# EAGLE design MaTouch 1.9“ TFT Breakout v1.1 (EAGLE 6.1)
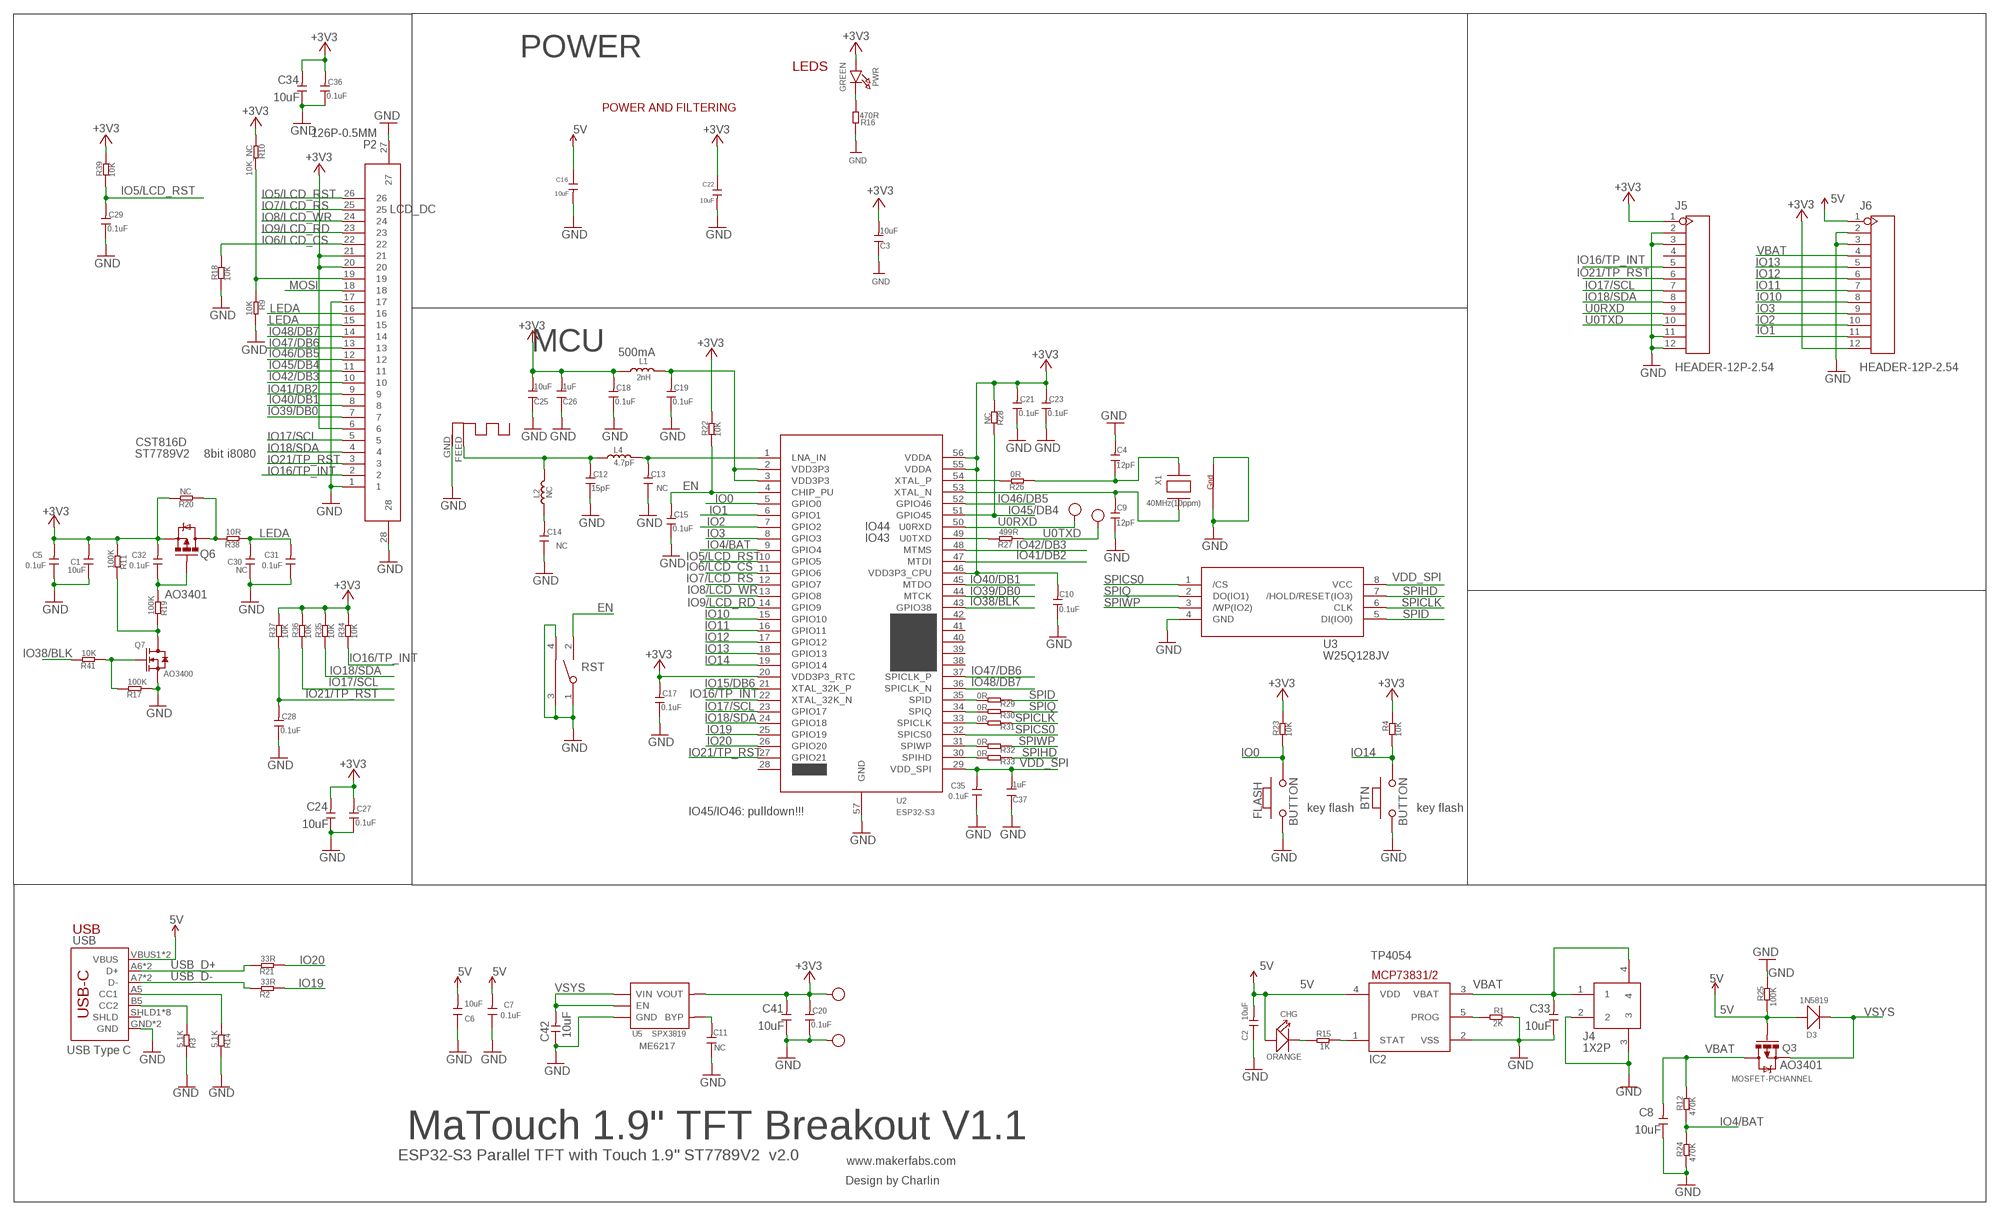
[diagram p0: schematic, sheet 1]

## Parts
ANT1  ANTENNA  [RN-ANT]
BTN  BUTTON  PB157  [157SW]
C1  10uF  C-0603  [0603]
C2  10uF  C-0603  [0603]
C3  10uF  DISCRETE_C-0603  [DISCRETE_C0603]
C4  12pF  DISCRETE_C-0402  [DISCRETE_C0402]
C5  0.1uF  DISCRETE_C-0402  [DISCRETE_C0402]
C6  10uF  DISCRETE_C-0603  [DISCRETE_C0603]
C7  0.1uF  DISCRETE_C-0402  [DISCRETE_C0402]
C8  10uF  C-0603  [0603]
C9  12pF  DISCRETE_C-0402  [DISCRETE_C0402]
C10  0.1uF  DISCRETE_C-0402  [DISCRETE_C0402]
C11  NC  DISCRETE_C-0402  [DISCRETE_C0402]
C12  15pF  DISCRETE_C-0402  [DISCRETE_C0402]
C13  NC  DISCRETE_C-0402  [DISCRETE_C0402]
C14  NC  DISCRETE_C-0402  [DISCRETE_C0402]
C15  0.1uF  DISCRETE_C-0402  [DISCRETE_C0402]
C16  10uF  C-0603  [0603]
C17  0.1uF  DISCRETE_C-0402  [DISCRETE_C0402]
C18  0.1uF  DISCRETE_C-0402  [DISCRETE_C0402]
C19  0.1uF  DISCRETE_C-0402  [DISCRETE_C0402]
C20  0.1uF  DISCRETE_C-0402  [DISCRETE_C0402]
C21  0.1uF  DISCRETE_C-0402  [DISCRETE_C0402]
C22  10uF  C-0603  [0603]
C23  0.1uF  DISCRETE_C-0402  [DISCRETE_C0402]
C24  10uF  C-0603  [0603]
C25  10uF  DISCRETE_C-0603  [DISCRETE_C0603]
C26  1uF  DISCRETE_C-0603  [DISCRETE_C0603]
C27  0.1uF  DISCRETE_C-0402  [DISCRETE_C0402]
C28  0.1uF  DISCRETE_C-0402  [DISCRETE_C0402]
C29  0.1uF  DISCRETE_C-0402  [DISCRETE_C0402]
C30  NC  C-0603  [0603]
C31  0.1uF  DISCRETE_C-0402  [DISCRETE_C0402]
C32  0.1uF  DISCRETE_C-0402  [DISCRETE_C0402]
C33  10uF  C-0603  [0603]
C34  10uF  C-0603  [0603]
C35  0.1uF  DISCRETE_C-0402  [DISCRETE_C0402]
C36  0.1uF  DISCRETE_C-0402  [DISCRETE_C0402]
C37  1uF  DISCRETE_C-0603  [DISCRETE_C0603]
C41  10uF  C-0603  [0603]
C42  10uF  C-0603  [0603]
CHG  ORANGE  007-LED0603  [D0603]
D3  1N5819  D'0805'  [SOD323]
FLASH  BUTTON  PB157  [157SW]
G  TEST-POINT'4545'  [TP-D45MIL]
IC2  MCP73831/OT  [SOT23-5L]
J4  1X2P  [1X2P-SMT1.25MM]
J5  HEADER-12P-2.54  [12P-2.54]
J6  HEADER-12P-2.54  [12P-2.54]
L1  2nH  DISCRETE_L0603  [DISCRETE_L0603]
L2  NC  DISCRETE_L0402  [DISCRETE_L0402]
L4  4.7pF  DISCRETE_L0402  [DISCRETE_L0402]
P2  126P-0.5MM  [1*26P-SMT0.5MM]
PWR  GREEN  LED0805_NOOUTLINE  [CHIPLED_0805_NOOUTLINE]
Q3  MOSFET-PCHANNEL  [SOT23-3]
Q6  MOSFET-PCHANNEL  [SOT23-3]
Q7  AO3400  DISCRETE_MOSFET-NSOT23  [DISCRETE_SOT23]
R1  2K  DISCRETE_R-0402  [DISCRETE_R0402]
R2  33R  DISCRETE_R-0402  [DISCRETE_R0402]
R3  5.1K  DISCRETE_R-0402  [DISCRETE_R0402]
R4  10K  DISCRETE_R-0402  [DISCRETE_R0402]
R9  10K  DISCRETE_R-0402  [DISCRETE_R0402]
R10  10K_NC  DISCRETE_R-0402  [DISCRETE_R0402]
R11  100K  DISCRETE_R-0402  [DISCRETE_R0402]
R12  470K  DISCRETE_R-0402  [DISCRETE_R0402]
R14  5.1K  DISCRETE_R-0402  [DISCRETE_R0402]
R15  1K  DISCRETE_R-0402  [DISCRETE_R0402]
R16  470R  DISCRETE_R-0402  [DISCRETE_R0402]
R17  100K  DISCRETE_R-0402  [DISCRETE_R0402]
R18  10K  DISCRETE_R-0402  [DISCRETE_R0402]
R19  100K  DISCRETE_R-0402  [DISCRETE_R0402]
R20  NC  DISCRETE_R-0402  [DISCRETE_R0402]
R21  33R  DISCRETE_R-0402  [DISCRETE_R0402]
R22  10K  DISCRETE_R-0402  [DISCRETE_R0402]
R23  10K  DISCRETE_R-0402  [DISCRETE_R0402]
R24  470K  DISCRETE_R-0402  [DISCRETE_R0402]
R25  100K  DISCRETE_R-0402  [DISCRETE_R0402]
R26  0R  DISCRETE_R-0402  [DISCRETE_R0402]
R27  499R  DISCRETE_R-0402  [DISCRETE_R0402]
R28  NC  DISCRETE_R-0402  [DISCRETE_R0402]
R29  0R  DISCRETE_R-0402  [DISCRETE_R0402]
R30  0R  DISCRETE_R-0402  [DISCRETE_R0402]
R31  0R  DISCRETE_R-0402  [DISCRETE_R0402]
R32  0R  DISCRETE_R-0402  [DISCRETE_R0402]
R33  0R  DISCRETE_R-0402  [DISCRETE_R0402]
R34  10K  DISCRETE_R-0402  [DISCRETE_R0402]
R35  10K  DISCRETE_R-0402  [DISCRETE_R0402]
R36  10K  DISCRETE_R-0402  [DISCRETE_R0402]
R37  10K  DISCRETE_R-0402  [DISCRETE_R0402]
R38  10R  DISCRETE_R-0402  [DISCRETE_R0402]
R39  10K  DISCRETE_R-0402  [DISCRETE_R0402]
R41  10K  DISCRETE_R-0402  [DISCRETE_R0402]
RST  TS24CA  [2*4*3.5MM]
RX  TEST-POINT'4545'  [TP-D45MIL]
TX  TEST-POINT'4545'  [TP-D45MIL]
U2  ESP32-S3  [QFN56-7*7MM]
U3  W25Q128JV  [SOIC-8-208MIL]
U5  SPX3819  [SOT23-5]
USB  USB_C5  [USB-C-16P-5]
V  TEST-POINT'4545'  [TP-D45MIL]
X1  40MHz(10ppm)  XTAL-4-3225  [NX3225]

## Nets
5V: C2.2 C6.2 C7.2 C16.1 CHG.+ D3.+ IC2.4(VDD) J6.1 Q3.1(G) R25.1 USB.VBUS1(VBUS) USB.VBUS2(VBUS)
+3V3: C1.2 C3.2 C5.2 C10.2 C17.2 C18.2 C20.2 C21.2 C22.1 C23.2 C24.2 C25.2 C26.2 C27.2 C32.2 C34.2 C36.2 C41.2 J5.1 J6.12 L1.1 P2.6 P2.20 P2.21 PWR.A Q6.2(S) R4.2 R10.2 R11.1 R20.2 R22.2 R23.2 R28.1 R34.2 R35.2 R36.2 R37.2 R39.2 U2.20(VDD3P3_RTC) U2.46(VDD3P3_CPU) U2.55(VDDA) U2.56(VDDA) U5.5(VOUT) V.T
EN: C15.2 R22.1 RST.2 U2.4(CHIP_PU)
GND: ANT1.GND BTN.1 C1.1 C2.1 C3.1 C4.2 C5.1 C6.1 C7.1 C8.1 C9.1 C10.1 C11.1 C12.1 C13.1 C14.1 C15.1 C16.2 C17.1 C18.1 C19.1 C20.1 C21.1 C22.2 C23.1 C24.1 C25.1 C26.1 C27.1 C28.1 C29.1 C30.1 C31.1 C33.1 C34.1 C35.1 C36.1 C37.1 C41.1 C42.1 FLASH.1 G.T IC2.2(VSS) J4.2 J4.3 J5.2 J5.3 J5.11 J5.12 J6.2 J6.3 P2.1 P2.17 P2.27 P2.28 Q7.2(S) R1.2 R3.2 R9.1 R14.2 R16.1 R17.1 R18.1 R24.1 R25.2 RST.1 RST.3 RST.4 U2.57(GND) U3.4(GND) U5.2(GND) USB.GND USB.GND2(GND) X1.2(G2) X1.4(G1)
IO0: FLASH.2 R23.1 U2.5(GPIO0)
IO1: J6.11 U2.6(GPIO1)
IO2: J6.10 U2.7(GPIO2)
IO3: J6.9 U2.8(GPIO3)
IO4/BAT: R12.1 R24.2 U2.9(GPIO4)
IO5/LCD_RST: C29.2 P2.26 R39.1 U2.10(GPIO5)
IO6/LCD_CS: P2.22 R18.2 U2.11(GPIO6)
IO7/LCD_RS: P2.25 U2.12(GPIO7)
IO8/LCD_WR: P2.24 U2.13(GPIO8)
IO9/LCD_RD: P2.23 U2.14(GPIO9)
IO10: J6.8 U2.15(GPIO10)
IO11: J6.7 U2.16(GPIO11)
IO12: J6.6 U2.17(GPIO12)
IO13: J6.5 U2.18(GPIO13)
IO14: BTN.2 R4.1 U2.19(GPIO14)
IO15/DB6: U2.21(XTAL_32K_P)
IO16/TP_INT: J5.5 P2.2 R34.1 U2.22(XTAL_32K_N)
IO17/SCL: J5.7 P2.5 R36.1 U2.23(GPIO17)
IO18/SDA: J5.8 P2.4 R35.1 U2.24(GPIO18)
IO19: R2.1 U2.25(GPIO19)
IO20: R21.1 U2.26(GPIO20)
IO21/TP_RST: C28.2 J5.6 P2.3 R37.1 U2.27(GPIO21)
IO38/BLK: R41.2 U2.43(GPIO38)
IO39/DB0: P2.7 U2.44(MTCK)
IO40/DB1: P2.8 U2.45(MTDO)
IO41/DB2: P2.9 U2.47(MTDI)
IO42/DB3: P2.10 U2.48(MTMS)
IO45/DB4: P2.11 R28.2 U2.51(GPIO45)
IO46/DB5: P2.12 U2.52(GPIO46)
IO47/DB6: P2.13 U2.37(SPICLK_P)
IO48/DB7: P2.14 U2.36(SPICLK_N)
LEDA: C30.2 C31.2 P2.15 P2.16 R38.1
MOSI: P2.18
N$2: IC2.5(PROG) R1.1
N$3: C32.1 Q6.1(G) R19.1
N$6: R14.1 USB.A5(CC1)
N$7: PWR.C R16.2
N$8: P2.19 R9.2 R10.1
N$10: Q6.3(D) R20.1 R38.2
N$14: R3.1 USB.B5(CC2)
N$15: Q7.3(D) R11.2 R19.2
N$19: Q7.1(G) R17.2 R41.1
N$25: CHG.- R15.1
N$26: IC2.1(STAT) R15.2
N$30: ANT1.FEED C12.2 L2.2 L4.1
N$31: C13.2 L4.2 U2.1(LNA_IN)
N$32: R29.2 U2.35(SPID)
N$33: C19.2 L1.2 U2.2(VDD3P3) U2.3(VDD3P3)
N$34: C14.2 L2.1
N$35: R30.2 U2.34(SPIQ)
N$37: R26.2 U2.54(XTAL_P)
N$38: R31.2 U2.33(SPICLK)
N$40: R32.2 U2.31(SPIWP)
N$41: R33.2 U2.30(SPIHD)
N$63: R27.2 U2.49(U0TXD)
N$65: C9.2 U2.53(XTAL_N) X1.3(X2)
N$66: C4.1 R26.1 X1.1(X1)
N$76: C11.2 U5.4(BYP)
SPICLK: R31.1 U3.6(CLK)
SPICS0: U2.32(SPICS0) U3.1(/CS)
SPID: R29.1 U3.5(DI(IO0))
SPIHD: R33.1 U3.7(/HOLD/RESET(IO3))
SPIQ: R30.1 U3.2(DO(IO1))
SPIWP: R32.1 U3.3(/WP(IO2))
U0RXD: J5.9 RX.T U2.50(U0RXD)
U0TXD: J5.10 R27.1 TX.T
USB_D+: R21.2 USB.A6(D+) USB.B6(D+)
USB_D-: R2.2 USB.A7(D-) USB.B7(D-)
VBAT: C8.2 C33.2 IC2.3(VBAT) J4.1 J4.4 J6.4 Q3.3(D) R12.2
VDD_SPI: C35.2 C37.2 U2.29(VDD_SPI) U3.8(VCC)
VSYS: C42.2 D3.- Q3.2(S) U5.1(VIN) U5.3(EN)
Unconnected: J5.4 U2.28(SPICS1) U2.38(GPIO33) U2.39(GPIO34) U2.40(GPIO35) U2.41(GPIO36) U2.42(GPIO37) USB.SHLD1(SHLD) USB.SHLD2(SHLD) USB.SHLD3(SHLD) USB.SHLD4(SHLD) USB.SHLD5(SHLD) USB.SHLD6(SHLD) USB.SHLD7(SHLD) USB.SHLD8(SHLD)

## Notes on the sheet
- POWER
- LEDS
- POWER AND FILTERING
- LCD_DC
- MCU
- 500mA
- CST816D
- ST7789V2 | 8bit i8080
- IO44
- IO43
- AO3401
- RST
- key flash | key flash
- IO45/IO46: pulldown!!!
- USB
- TP4054
- ME6217
- USB Type C
- AO3401
- MaTouch 1.9" TFT Breakout V1.1
- ESP32-S3 Parallel TFT with Touch 1.9" ST7789V2  v2.0
- www.makerfabs.com
- Design by Charlin

## Library data of the parts
ANT1 = adafruit:ANTENNA
BTN FLASH = MySMD:PB157
C1 C2 C8 C16 C22 C24 C30 C33 C34 C41 C42 = Discrete:C*: Ceramic Capacitors
C3-C7 C9-C15 C17-C21 C23 C25-C29 C31 C32 C35-C37 = A9G:DISCRETE_C*: Ceramic Capacitors
CHG = Discrete:007-LED*
D3 = Discrete:D*
G RX TX V = Discrete-new:TEST-POINT; PARTNO: DNP
IC2 = adafruit:MCP73831: MCP73831/2 Miniature Single-Cell, Fully Integrated Li-Ion, Li-Polymer Charge Management Controllers. Nice and small simple lipoly charge controller, with adjustable current and status output (LED) http://www.ladyada.net/library/pcb/eaglelibrary.html
J4 = sale:1X2P
J5 J6 = Connector:HEADER-12P
L1 L2 L4 = A9G:DISCRETE_L*
P2 = sale:1*26P-0.5MM
PWR = microbuilder:LED: LED 0603 - 0603 Surface Mount Package 2mA: Green LED - Low Power (3.9mcd, 2ma, 1.7Vf) - Digikey: 475-2709-2-ND Orange LED - Low Power (9.8mcd, 2ma, 1.8Vf) - Digikey: 475-1194-2-ND Red LED - Low Power (5mcd, 2ma, 1.8Vf) - Digikey: 475-1195-2-ND Yellow LED - Low Power (7mcd, 2ma, 1.8Vf) - Digikey: 475-1196-2-ND 5mA: Blue LED - Low Power (17mcd, 5ma, 2.9Vf) - Digikey: LNJ937W8CRACT-ND 0805 - 0805 Surface Mount Package 2mA: Red LED (8.8mcd, 2mA, 1.8Vf, Clear) - Low Power [Digikey: 475-2510-1-ND] Green LED (5mcd, 2mA, 1.8Vf, Clear) - Low Power [Digikey: 475-2730-1-ND] Yellow LED (11.3mcd, 2mA, 1.8Vf, Clear) - Low Power [Digikey: 475-2555-1-ND] 20mA: Red LED (104mcd, 20mA, Diffused) - LS R976 [Digikey: 475-1278-6-ND] Red LED (12mcd, 20mA, 2.0Vf, Clear) - APT2012EC [Digikey: 754-1128-1-ND] Green LED (15mcd, 20mA, 2.2Vf, Clear) - APT2012GC [Digikey: 754-1131-1-ND] Orange LED (160mcd, 20mA, 2.1Vf, Clear) - APT2012SECK [Digikey: 754-1130-1-ND] 1206 - 1206 Surface Mount Package Green LED (26mcd, 20mA, Diffused) - LG N971 [Digikey: 475-1407-6-ND] Red LED (15mcd, 20mA, Diffused) - LH N974 [Digikey: 475-1416-6-ND] Cree - Cree High-Power Surface Mount LEDs XPEBWT-L1-0000-00D50 - White 111lm 350mA 2.9Vf 6200K 110° XTEAWT-00-0000-00000LEE3 - White 114lm 350mA 2.85Vf 5000K 115° Everlight - Everlight 45-21 Series Surface Mount LEDs 45-21/QK2C-B2832AC2CB2/2T - Warm White 2000mcd 20mA 3.25Vf 3050K 120° 45-21/LK2C-B38452C4CB2/2T - Nuetral White 2000mcd 20mA 3.25Vf 4150K 120° 45-21/LK2C-B50634C6CB2/2T - Cold White 2200mcd 20mA 3.25Vf 5650K 120° PLCC2 Reverse Mount LS T77K-J1L2-1-0-2-R18-Z - Red 11.25mcd 2mA 1.8Vf 630nm 120° LO T77K-L1M2-24-Z - Orange 19.6mcd 2mA 1.8Vf 606nm 120° LY T77K-K2M1-26-Z - Yellow 15.7mcd 2mA 1.8Vf 587nm 120°
Q3 Q6 = User-Submitted:MOSFET-PCHANNEL: Generic PMOSFET IRLML2244 - TRANS-11153 (SOT-23 -20V -4.3A) (1.Gate 2.Source 3.Drain) FQP27P06 - COM-10349 <http://www.sparkfun.com/products/10349> (TO-220 -60V -27A) (1.Gate 2.Source 3.Drain); PROD_ID: TRANS-08285
Q7 = A9G:DISCRETE_MOSFET-N: IRLL014: http://www.vishay.com/docs/91319/sihll014.pdf
R1-R4 R9-R12 R14-R39 R41 = A9G:DISCRETE_R*
RST = sale:TS24CA
U2 = sale:ESP32-S3
U3 = self:W25Q128JV
U5 = IC:SPX3819
USB = USBC:USB_C: USB Type C 16Pin Connector Super Speed pins not available on the 16-pin purely SMD connector so this part is best for USB 2.0 implementations. D1 and D2 are tied together enabling D+/- no matter which way the cable is plugged into the connector. The two channel configuration pins (CC1/2) are exposed. These are normally connected to ground via 5.1k resistors but can be reconfigured for high current/high power applications.
X1 = adafruit:XTAL-4: Classic 4-pin 3.2 x 2.5mm crystal

## Net classes
0 default: width 0.203 mm
1 vbat: width 0.254 mm, drill 0.305 mm, clearance 0.152 mm

## Board
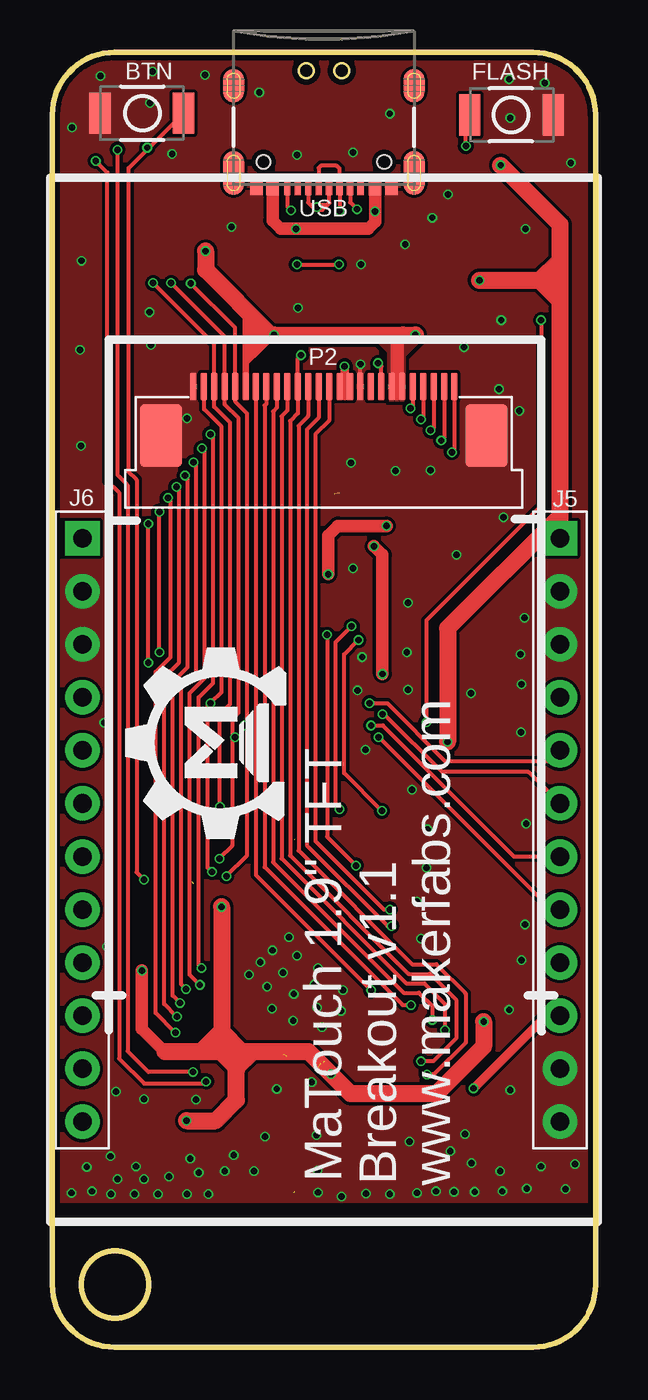
[diagram p1: board, top side]
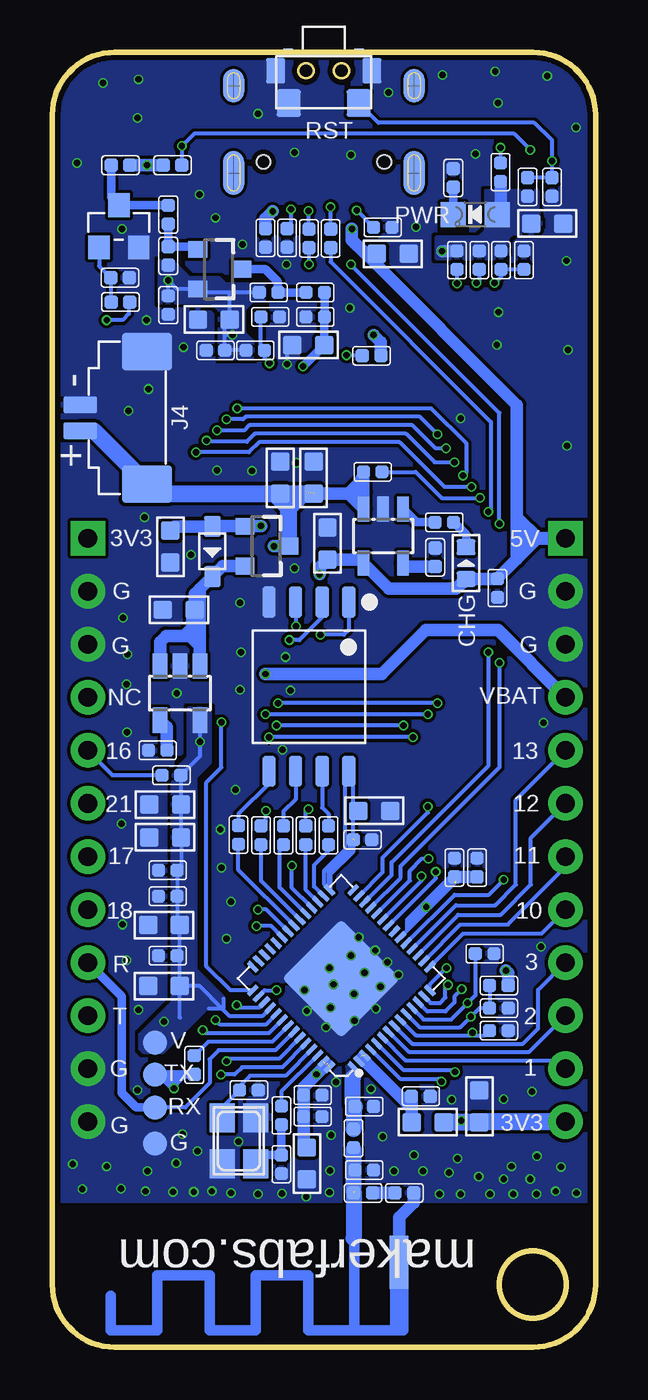
[diagram p2: board, bottom side, seen from below]

Size 26 x 62 mm. Coordinates in mm from the lower left corner, seen from the top.
Outline: 0,3 0,59 arc-90 3,62 23,62 arc-90 26,59 26,3 arc-90 23,0 3,0 arc-90 0,3
Outline: circle at 3,3 radius 1.6
Copper layers (1*16): Top 0.035mm / dielectric 1.5mm / Bottom 0.035mm
Design rules: minimum track width 6mil, minimum drill 10mil, track to track 6mil, track to pad 6mil, pad to pad 6mil, via to via 6mil, smd to smd 0mil, copper to edge 10mil, drill to drill 10mil, minimum pad ring 3mil, minimum via ring 3mil, stop-mask expansion 2mil, vias tented up to drill 100mil, thermal gap 0mil
tRestrict: area -0.1,-0.1 to 26,6.9
bRestrict: area -0.1,-0.1 to 26,6.9

### Footprints (pad centres in the part's own frame; a part is rotated, then mirrored left to right if it is on the bottom)
RN-ANT = smd 0.025 x 0.025: FEED 0,2.159 | smd 2.54 x 0.889: GND -1.143,0
157SW = smd 1.016 x 1.981: 1 0,0; 2 4,0
0603 = smd 0.889 x 0.889: 1 -0.762,0; 2 0.762,0
DISCRETE_C0603 = smd 0.889 x 0.889: 1 -0.762,0; 2 0.762,0
DISCRETE_C0402 = smd 0.635 x 0.635: 1 -0.445,0; 2 0.445,0
D0603 = smd 0.762 x 0.889: + -0.762,0; - 0.762,0
SOD323 = smd 1 x 0.8: + -1.2,0; - 1.2,0
TP-D45MIL = smd 1.143 x 1.143: T 0,0
SOT23-5L = smd 0.55 x 1.2: 1 -0.95,-1.3; 2 0,-1.3; 3 0.95,-1.3; 4 0.95,1.3; 5 -0.95,1.3
1X2P-SMT1.25MM = smd 0.8 x 1.6: 1 -0.625,0; 2 0.625,0 | smd 1.8 x 2.4: 3 3.175,-3.2; 4 -3.175,-3.2
12P-2.54 = drill 0.889 pad 1.651 square: 1 0,13.97 | drill 0.889 pad 1.651: 2 0,11.43; 3 0,8.89; 4 0,6.35; 5 0,3.81; 6 0,1.27; 7 0,-1.27; 8 0,-3.81; 9 0,-6.35; 10 0,-8.89; 11 0,-11.43; 12 0,-13.97
DISCRETE_L0603 = smd 0.889 x 0.889: 1 -0.762,0; 2 0.762,0
DISCRETE_L0402 = smd 0.635 x 0.635: 1 -0.445,0; 2 0.445,0
1*26P-SMT0.5MM = smd 0.3 x 1.3: 1 -6.25,0; 2 -5.75,0; 3 -5.25,0; 4 -4.75,0; 5 -4.25,0; 6 -3.75,0; 7 -3.25,0; 8 -2.75,0; 9 -2.25,0; 10 -1.75,0; 11 -1.25,0; 12 -0.75,0; 13 -0.25,0; 14 0.25,0; 15 0.75,0; 16 1.25,0; 17 1.75,0; 18 2.25,0; 19 2.75,0; 20 3.25,0; 21 3.75,0; 22 4.25,0; 23 4.75,0; 24 5.25,0; 25 5.75,0; 26 6.25,0 | smd 2 x 3: 27 7.79,-2.35; 28 -7.79,-2.35
CHIPLED_0805_NOOUTLINE = smd 1.2 x 1.2: A 0,-1.05; C 0,1.05
SOT23-3 = smd 0.8 x 0.9: 1 -0.95,-1; 2 0.95,-1; 3 0,1.1
DISCRETE_SOT23 = smd 1.016 x 1.143: 1 -0.95,-1.016; 2 0.95,-1.016; 3 0,1.016
DISCRETE_R0402 = smd 0.635 x 0.635: 1 -0.445,0; 2 0.445,0
2*4*3.5MM = smd 1.15 x 1.3: 1 -1.675,0; 2 1.675,0 | smd 0.9 x 1.2: 3 2.3,1.55; 4 -2.3,1.55
QFN56-7*7MM = smd 0.6 x 0.2: 1 -3.4,2.6; 2 -3.4,2.2; 3 -3.4,1.8; 4 -3.4,1.4; 5 -3.4,1; 6 -3.4,0.6; 7 -3.4,0.2; 8 -3.4,-0.2; 9 -3.4,-0.6; 10 -3.4,-1; 11 -3.4,-1.4; 12 -3.4,-1.8; 13 -3.4,-2.2; 14 -3.4,-2.6; 29 3.4,-2.6; 30 3.4,-2.2; 31 3.4,-1.8; 32 3.4,-1.4; 33 3.4,-1; 34 3.4,-0.6; 35 3.4,-0.2; 36 3.4,0.2; 37 3.4,0.6; 38 3.4,1; 39 3.4,1.4; 40 3.4,1.8; 41 3.4,2.2; 42 3.4,2.6 | smd 0.2 x 0.6: 15 -2.6,-3.4; 16 -2.2,-3.4; 17 -1.8,-3.4; 18 -1.4,-3.4; 19 -1,-3.4; 20 -0.6,-3.4; 21 -0.2,-3.4; 22 0.2,-3.4; 23 0.6,-3.4; 24 1,-3.4; 25 1.4,-3.4; 26 1.8,-3.4; 27 2.2,-3.4; 28 2.6,-3.4; 43 2.6,3.4; 44 2.2,3.4; 45 1.8,3.4; 46 1.4,3.4; 47 1,3.4; 48 0.6,3.4; 49 0.2,3.4; 50 -0.2,3.4; 51 -0.6,3.4; 52 -1,3.4; 53 -1.4,3.4; 54 -1.8,3.4; 55 -2.2,3.4; 56 -2.6,3.4 | smd 4 x 4: 57 0,0
SOIC-8-208MIL = smd 1.5 x 0.635: 1 -4.05,1.905; 2 -4.05,0.635; 3 -4.05,-0.635; 4 -4.05,-1.905; 5 4.05,-1.905; 6 4.05,-0.635; 7 4.05,0.635; 8 4.05,1.905
SOT23-5 = smd 0.69 x 1.2: 1 -0.95,-1.3; 2 0,-1.3; 3 0.95,-1.3; 4 0.95,1.3; 5 -0.95,1.3
USB-C-16P-5 = smd 0.3 x 1: A5 -1.25,-0.34; A6 -0.25,-0.34; A7 0.25,-0.34; A8 1.25,-0.34; B5 1.75,-0.34; B6 0.75,-0.34; B7 -0.75,-0.34; B8 -1.75,-0.34 | smd 0.6 x 1: GND -3.225,-0.34; GND2 3.225,-0.34; VBUS1 -2.45,-0.34; VBUS2 2.45,-0.34 | smd 1 x 2.1: SHLD1 -4.32,-0.915; SHLD2 4.32,-0.915 | smd 1 x 2.1 bottom: SHLD3 -4.32,-0.915; SHLD4 4.32,-0.915 | smd 1 x 1.6: SHLD5 -4.32,-5.095; SHLD8 4.32,-5.095 | smd 1 x 1.6 bottom: SHLD6 -4.32,-5.095; SHLD7 4.32,-5.095 | hole 0.65: -2.89,-1.445; 2.89,-1.445
NX3225 = smd 1.4 x 1.2: 1 -1.1,-0.8; 2 1.1,-0.8; 3 1.1,0.8; 4 -1.1,0.8

### Placement (x,y rotation side)
ANT1  9.4,5.21 90 bottom
BTN  2.29,59.08 0 top
C1  20.65,20.22 0 bottom
C2  12.83,38.48 270 bottom
C3  20.65,17.3 0 bottom
C4  15.04,8.76 270 bottom
C5  20.45,49.89 90 bottom
C6  20.35,38.33 90 bottom
C7  15.8,53.11 90 bottom
C8  15.09,41.63 270 bottom
C9  16.59,12.32 180 bottom
C10  5.66,22.96 270 bottom
C11  20.95,28.57 0 bottom
C12  11.07,8.48 180 bottom
C13  11.07,11.53 180 bottom
C14  9.14,7.39 180 bottom
C15  2.08,55.55 90 bottom
C16  9.71,52.35 0 bottom
C17  13.54,11.05 180 bottom
C18  13.54,12.06 180 bottom
C19  8.36,12.01 180 bottom
C20  6.76,22.96 270 bottom
C21  20.47,18.75 0 bottom
C22  13.81,8.8 270 bottom
C23  20.47,21.59 0 bottom
C24  5.56,11.53 270 bottom
C25  2.31,53.8 180 bottom
C26  20.6,24.41 0 bottom
C27  20.47,22.83 0 bottom
C28  3.43,52.04 270 bottom
C29  4.62,16.23 180 bottom
C30  13.74,47.98 0 bottom
C31  13.41,49.33 0 bottom
C32  20.45,52.25 270 bottom
C33  13.49,41.63 270 bottom
C34  20.6,25.98 0 bottom
C35  11.15,24.31 180 bottom
C36  18.19,47.73 0 bottom
C37  10.59,25.68 180 bottom
C41  18.26,49.2 0 bottom
C42  19.94,35.31 0 bottom
CHG  6.2,37.54 90 bottom
D3  18.34,38.1 270 bottom
FLASH  23.98,59 180 top
G  21.08,9.75 0 bottom
IC2  10.16,38.84 180 bottom
J4  24.66,44.5 90 bottom
J5  24.3,24.77 0 top
J6  1.44,24.77 0 top
L1  8.03,10.77 180 bottom
L2  11.13,7.39 180 bottom
L4  11.58,10.01 90 bottom
P2  13,46 0 top
PWR  5.76,54.23 90 bottom
Q3  15.77,38.35 270 bottom
Q6  18.03,51.61 270 bottom
Q7  22.81,53.67 0 bottom
R1  7.67,37.82 90 bottom
R2  13.72,53.09 90 bottom
R3  10.19,53.62 0 bottom
R4  4.55,56.26 270 bottom
R9  15.57,49.33 180 bottom
R10  16.28,47.73 180 bottom
R11  22.73,56.59 180 bottom
R12  10.67,41.91 180 bottom
R14  14.76,53.11 270 bottom
R15  7.24,39.5 180 bottom
R16  6.81,55.98 270 bottom
R17  22.76,51.21 180 bottom
R18  5.31,18.85 180 bottom
R19  20.45,54.23 90 bottom
R20  15.65,50.5 180 bottom
R21  12.67,53.09 90 bottom
R22  3.25,55.55 270 bottom
R23  20.24,56.59 180 bottom
R24  4.62,15.16 180 bottom
R25  4.7,36.35 270 bottom
R26  15.04,11.1 90 bottom
R27  19.2,13.51 90 bottom
R28  10.72,47.47 180 bottom
R29  17.09,24.54 270 bottom
R30  16,24.51 270 bottom
R31  14.94,24.51 270 bottom
R32  13.87,24.51 270 bottom
R33  12.78,24.51 270 bottom
R34  20.29,27.38 0 bottom
R35  5.56,52.04 90 bottom
R36  6.63,52.04 90 bottom
R37  4.52,52.04 90 bottom
R38  13.41,50.5 180 bottom
R39  4.62,17.32 0 bottom
R41  22.73,50.04 0 bottom
RST  13,59.56 0 bottom
RX  21.08,11.48 0 bottom
TX  21.08,13.06 0 bottom
U2  12.17,17.65 135 bottom
U3  13.72,31.62 270 bottom
U5  19.89,31.32 180 bottom
U$1  [MAKERFABS_0.3]  11.12,24.82 90 top
USB  13,55.3 180 top
V  21.08,14.58 0 bottom
X1  17.07,9.88 90 bottom

### Tracks (layer width: path | path; a pad name or v marks a point on that pad's centre or on a via)
5V  (via drill 0.3)
  Top 0.61: USB.VBUS1 v15.45,54.38 15.45,53.88 15.11,53.54 v11.66,53.54 10.95,53.54 10.55,53.94 USB.VBUS2 | v13.21,37.01 13.21,38.86 13.66,39.32 v16,39.32
  Bottom 0.203: 16.76,39.32 Q3.1
  Bottom 0.61: v16,39.32 16.76,39.32 | Q3.1 D3.+ 20.14,39.3 C6.2 | C7.2 15.8,54.03 v15.45,54.38 | v11.66,53.54 11.66,53.01 11,52.35 | 11,52.35 C16.1 | 3.76,37.73 R25.1 4.71,36.78 CHG.+ 6.66,36.32 9.89,36.32 IC2.4 11.29,37.72 C2.2 13.21,37.34 v13.21,37.01 | 3.76,37.73 3.76,39.09 | 3.76,39.73 3.76,45.11 11,52.35 | J6.1 2.76,38.73 3.76,37.73 | 1.45,38.71 2.74,38.71 3.76,39.73 | 3.76,39.73 3.76,39.09 | 3.76,39.09 3.23,38.56
+3V3  (via drill 0.3)  (4 unrouted)
  Top 0.203: P2.21 16.75,48.42 16.79,48.46
  Top 0.305: P2.6 9.25,47.14 | 9.25,47.14 v10.62,48.46 | 9.25,47.14 9.25,49.63
  Top 0.406: 9.25,49.63 9.53,49.4 9.53,47.57 9.83,47.88 9.83,48.67 10.11,48.39 10.11,48.08
  Top 0.61: 16.48,45.64 16.48,48.36 | 5.38,14.15 4.29,15.24 v4.29,18.03 | 6.99,14.2 8.08,15.29 9.22,14.15 9.73,14.15 8.81,13.23 7.95,14.1
  Top 0.813: v7.34,52.48 7.34,51.59 10.46,48.46 v10.62,48.46 16.79,48.46 v17.37,48.46 | J5.1 24.3,39.8 | 24.3,39.8 24.3,50.95 | 24.3,50.95 24.3,53.75 v21.46,56.59 | v20.45,51.08 23.32,51.08 | 23.32,51.08 23.34,51.08 | 23.34,51.08 24.17,51.08 24.3,50.95 | 23.34,51.08 24.28,52.02 24.28,50.11 23.32,51.08 | v18.92,28.98 18.92,34.42 24.3,39.8 | v20.65,15.6 20.65,14.4 18.39,12.14 14.28,12.14 v13.35,13.07 12.27,14.15 9.73,14.15 8.84,14.15 | 8.84,14.15 8.18,14.15 | 8.18,14.15 5.38,14.15 | v6.43,10.85 7.82,10.85 8.81,11.84 8.81,13.23 8.81,14.12 8.84,14.15 | v8.1,21.08 8.1,14.22 8.18,14.15
  Bottom 0.203: U2.20 8.05,20.92 | 8.05,20.92 6.76,22.21 C20.2 C10.2 | U2.46 15.95,15.85 17.5,15.85 17.8,16.15 | U5.5 18.94,28.29 R34.2 19.85,26 C34.2 C26.2 19.84,23.02 C27.2 C23.2 20.03,20.36 C1.2 19.89,18.8 | 17.86,16.2 18.95,17.3 C3.2 | 19.89,15.77 C3.2 | 6.64,52.48 R36.2 | 16.75,47.7 R10.2 C36.2 17.74,48.46 | 17.74,48.46 17.74,48.96 C41.2 17.5,50.44 17.55,50.49 | R20.2 17.55,50.49 | 17.55,50.49 18.87,50.49 Q6.2 20.03,50.66 v20.45,51.08 C5.2 | 4.55,54.39 PWR.A | 5.54,10.79 6.38,10.79 v6.43,10.85 | v17.37,48.46 17.74,48.46 | C3.2 19.89,18.8 | C21.2 19.94,18.75 19.89,18.8 | 17.8,16.69 17.8,16.15 | 17.8,16.15 17.86,16.2 | 17.86,16.2 18.49,16.2 | v8.1,21.08 8.1,20.98 8.05,20.92 | 9.02,19.96 9.02,20.47 6.76,22.73 5.49,22.73 5.49,22.3 6.68,22.3 8.71,20.27 8.91,20.27 8.91,20.32 6.63,22.61 5.94,22.61 5.94,22.4 6.5,22.4 6.5,22.43 | 12.6,13.59 12.85,13.84 14.15,12.55 14.15,9.86 13.77,9.86 13.77,12.37 12.57,13.56 12.6,13.59 | 12.6,13.59 12.83,13.59 14.05,12.37 14.05,11.73
  Bottom 0.305: C18.2 13.87,12.18 13.87,12.55 v13.35,13.07 12.9,13.51 12.9,13.54 12.98,13.61
  Bottom 0.406: C18.2 13.97,11.06 | 13.97,11.06 13.97,9.58 13.95,9.55 13.84,9.55 13.83,9.56 C22.1 | C17.2 13.97,11.06
  Bottom 0.61: v7.34,52.48 6.64,52.48 | 4.55,54.39 R4.2 | R28.1 10.27,48.12 v10.62,48.46 | R23.2 v21.46,56.59 R11.1 | R39.2 4.18,17.92 v4.29,18.03
  Bottom 0.813: J6.12 5.54,10.79 C24.2 L1.1
  pour Bottom: 7.62,52.15 4.37,52.15 4.19,52.32 4.19,53.11 3.96,53.34 2.62,53.34 2.62,54.23 2.77,54.38 2.77,55.35 5.26,55.35 5.26,53.44 5.59,53.11 7.62,53.11
  pour Bottom: 16.43,47.32 17.98,47.32 17.98,49.66 18.34,50.01 20.85,50.01 20.85,52.04 20.29,52.04 19.46,51.21 18.03,51.21 17.73,50.9 15.85,50.9 15.85,50.09 16.43,50.09 16.84,49.68 16.84,48.56 16.46,48.18 16.43,48.16
  pour Top: 16.1,45.36 16.84,45.36 16.84,47.5 17.6,48.26 17.6,48.59 15.42,48.59 15.42,48.36 16.1,47.68
  pour Bottom: 18.47,30.61 18.47,27.97 19.15,27.28 19.15,18.08 17.81,16.74 17.81,16.43 18.03,16.21 18.62,16.21 20.7,14.12 21.62,14.12 21.79,14.3 21.79,14.96 20.47,16.28 20.24,16.51 20.24,27.48 19.46,28.27 19.46,30.58 19.43,30.61
EN  (via drill 0.3)
  Top 0.203: v7.37,12.72 7.26,12.62 4.39,12.62 3.2,13.82 3.2,40.92 2.64,41.48 2.64,56.24 v2.08,56.79
  Bottom 0.203: U2.4 9.35,12.85 7.49,12.85 v7.37,12.72 | R22.1 C15.2 v2.08,56.79 2.08,57.78 2.92,58.62 10.39,58.62 RST.2
GND  (via drill 0.3)
  Top 0.203: P2.17 14.75,47.06 v14.76,47.07
  Bottom 0.203: v14.76,47.07 14.76,47.73 C30.1
  Bottom 0.61: ANT1.GND 9.4,6.22 8.7,6.92 C14.1
  other vias: 16.43,41.96 18.11,41.99 14.4,37.29 14.83,33.05 14.61,31.45 17.02,31.47 17.02,35.64 21.59,39.73 21.39,45.87 18.95,55.19 18.19,54.08 22.66,53.54 21.49,49.17 19.71,47.88 16.15,59.05 21.87,60.71 23.57,60.53 24.82,56.69 21.92,58.85 4.8,61.09 2.31,60.86 0.94,58.39 4.67,59.56 7.32,60.91 9.91,60.07 11.71,57.07 14.4,57.2 5.74,57.12 8.59,53.64 1.4,52.02 1.37,43.15 1.32,47.75 4.65,49.56 6.45,44.48 2.49,29.9 2.62,19.18 3.05,12.24 1.65,8.64 4.01,8.66 6.6,9.04 8.69,9.19 10.19,10.08 0.91,7.39 1.91,7.47 2.82,7.34 3.94,7.34 5.05,7.34 6.45,7.34 7.47,7.34 9.65,8.43 8.26,8.43 7.01,8.36 5.59,8.18 4.39,8.05 3.12,8.05 2.79,9.14 10.74,12.37 12.42,12.7 12.65,10.16 12.7,8.46 12.73,7.42 15.01,7.37 13.84,7.21 16.15,7.34 17.45,7.39 18.36,7.47 20.22,7.44 21.54,7.47 22.71,7.59 24.56,7.57 25.02,8.76 19.76,10.21 20.07,8.81 9.42,17.83 9.96,18.44 10.54,19 11.33,19.63 11.71,18.75 11.05,17.93 10.29,17.27 10.52,16.21 11.56,16.92 12.73,18.16 13.92,17.09 12.55,17.37 12.67,16.26 11.53,15.65 13.82,16.1 12.9,15.32 17.65,19.56 17.45,21.34 17.91,22.96 17.96,24.79 17.22,26.7 22.68,25.07 22.43,29.44 22.61,34.92 22.45,31.75 22.45,18.54 22.63,20.24 21.87,16.15 21.92,12.32 17.09,9.86 20.04,31.32 22.4,33.17 16.97,33.27 19.35,37.95 14.3,42.34 11.76,49.76 14.78,51.84 16.89,52.81 4.72,47.98 14.99,28.6 4.39,11.89 6.88,11.86 19.05,9.4 19.23,7.44 21.44,8.43 23.39,8.66 22.35,44.83
  pour Top (rank 6): -3,85 -3,-5 30,-5 30,85
  pour Bottom (rank 6): -5,-5 30,-5 30,85 -5,85
IO0  (via drill 0.3)
  Top 0.203: v3.12,57.33 3.12,41.76 3.61,41.27 3.61,14.17 4.6,13.18 v6.73,13.18 | v19.8,57.51 19.8,58.82 FLASH.2
  Bottom 0.203: U2.5 9.21,13.28 6.83,13.28 v6.73,13.18 | v3.12,57.33 3.89,58.09 19.21,58.09 v19.8,57.51 R23.1
IO1
  Bottom 0.203: U2.6 9.1,13.74 1.85,13.74 J6.11
IO2
  Bottom 0.203: U2.7 8.94,14.15 3.17,14.15 J6.10
IO3
  Bottom 0.203: U2.8 8.76,14.53 3.48,14.53 2.74,15.27 2.74,17.11 J6.9
IO4/BAT  (via drill 0.3)
  Top 0.203: v5.89,15.06 4.95,16 4.95,32.33 5.66,33.05 5.66,40.54 v5.54,40.66
  Bottom 0.203: U2.9 8.6,14.94 5.89,14.94 | 5.89,14.94 5.3,14.94 R24.2 | v5.89,15.06 5.89,14.94 | R12.1 8.61,41.91 7.37,40.66 v5.54,40.66
IO5/LCD_RST  (via drill 0.3)
  Top 0.203: v5.97,15.82 5.36,16.43 5.36,32.08 6.07,32.79 6.07,41.07 v5.94,41.2 | P2.26 19.25,42.97 v19.13,42.85
  Bottom 0.203: U2.10 8.42,15.32 6.48,15.32 v5.97,15.82 5.56,16.23 C29.2 R39.1 | v19.13,42.85 16.59,42.85 16.1,43.33 9.37,43.33 7.24,41.2 v5.94,41.2
IO6/LCD_CS  (via drill 0.3)
  Top 0.203: P2.22 17.25,45.06 v17.14,44.96 | v6.12,16.48 5.77,16.84 5.77,31.85 6.48,32.56 6.48,41.6 v6.35,41.73
  Bottom 0.203: U2.11 8.23,15.7 6.91,15.7 v6.12,16.48 5.75,16.85 R18.2 | v17.14,44.96 7.87,44.96 6.2,43.28 6.2,41.88 v6.35,41.73
IO7/LCD_RS  (via drill 0.3)
  Top 0.203: P2.25 18.77,45.98 18.77,43.56 v18.62,43.41 | v6.4,17.14 6.17,17.37 6.17,31.62 6.88,32.33 6.88,42.24 v6.76,42.37
  Bottom 0.203: U2.12 8.05,16.08 7.19,16.08 6.76,16.51 6.76,16.79 v6.4,17.14 | v18.62,43.41 18.57,43.36 16.69,43.36 16.31,43.74 9.07,43.74 7.7,42.37 v6.76,42.37
IO8/LCD_WR  (via drill 0.3)
  Top 0.203: P2.24 18.26,45.99 18.26,44.04 v18.11,43.89 | v7.06,17.35 6.58,17.83 6.58,31.32 7.29,32.03 7.29,42.9 v7.16,43.03
  Bottom 0.203: U2.13 7.89,16.48 7.44,16.48 7.19,16.74 7.19,17.22 v7.06,17.35 | v7.16,43.03 7.64,43.03 8.76,44.15 16.56,44.15 16.82,43.89 v18.11,43.89
IO9/LCD_RD  (via drill 0.3)
  Top 0.203: v7.14,18.16 7.01,18.29 7.01,31.11 7.7,31.8 7.7,43.59 v7.57,43.71 | P2.23 17.75,44.52 v17.65,44.42
  Bottom 0.203: U2.14 7.92,17.37 v7.14,18.16 | v7.57,43.71 8.41,44.55 16.74,44.55 16.87,44.42 v17.65,44.42
IO10
  Bottom 0.203: U2.15 6.33,19.81 2.58,19.81 J6.8
IO11
  Bottom 0.203: U2.16 6.46,20.24 4.19,20.24 1.44,23 J6.7
IO12
  Bottom 0.203: U2.17 6.57,20.7 4.55,20.7 3.1,22.15 3.1,24.38 J6.6
IO13
  Bottom 0.203: U2.18 6.68,21.16 4.8,21.16 3.81,22.15 3.81,26.2 J6.5
IO14  (via drill 0.3)
  Top 0.203: BTN.2 4.55,57.34 | 4.55,57.34 3.66,56.45 3.66,41.91 4.04,41.53 4.04,22.73 v4.39,22.38 | 4.55,57.34 v4.55,57.43
  Bottom 0.203: U2.19 6.74,21.67 5.11,21.67 v4.39,22.38 | R4.1 v4.55,57.43
IO16/TP_INT  (via drill 0.3)
  Top 0.203: P2.2 7.26,45.99 7.26,44.91 8.1,44.07 8.1,31.37 v7.57,30.84 7.44,30.71 7.44,22.96 v7.64,22.76 | v15.19,30.84 16.03,30.84 18.8,28.07 23.79,28.07 J5.5
  Bottom 0.203: U2.22 7.64,22.45 v7.64,22.76 | U2.22 10.03,20.07 10.06,20.07 | U2.22 | v7.57,30.84 v15.19,30.84 | R34.1 23.11,27.38 J5.5
IO17/SCL  (via drill 0.3)
  Top 0.203: 9.32,29.74 9.32,23.55 v8.33,22.55 | 9.32,29.74 9.32,44.7 8.76,45.26 8.76,45.99 P2.5 8.75,48.81 v6.63,50.93 | v9.2,29.77 9.3,29.77 9.32,29.74 | v15.27,29.77 15.82,29.77 22.1,23.5 J5.7
  Bottom 0.203: U2.23 8.33,22.33 v8.33,22.55 | v9.2,29.77 v15.27,29.77 | R36.1 v6.63,50.93
IO18/SDA  (via drill 0.3)
  Top 0.203: 8.23,45.98 P2.4 | 8.61,29.21 8.61,30.07 8.91,30.38 8.91,44.48 8.25,45.14 P2.4 | 8.61,29.21 8.61,24 v8,23.39 | P2.4 8.25,48.39 v5.69,50.95 | v8.74,29.21 8.61,29.21 | v15.62,29.21 23.88,20.95 J5.8
  Bottom 0.203: U2.24 8.89,22.34 8.89,22.81 8.31,23.39 v8,23.39 | v8.74,29.21 v15.62,29.21 | R35.1 5.56,51.08 v5.69,50.95
IO19  (via drill 0.3)
  Top 0.203: v4.6,32.77 v4.6,39.42 | v11.71,51.84 v13.72,51.84
  Bottom 0.203: U2.25 9.32,22.48 9.32,23.04 4.6,27.76 v4.6,32.77 | v4.6,39.42 4.6,44.73 v11.71,51.84 | R2.1 v13.72,51.84
IO20  (via drill 0.3)
  Top 0.203: v5.13,33.27 v5.13,40.01
  Bottom 0.203: U2.26 9.75,22.61 9.75,23.22 5.13,27.84 v5.13,33.27 | R21.1 12.68,51.97 5,44.3 5,40.13 v5.13,40.01
IO21/TP_RST  (via drill 0.3)
  Top 0.203: P2.3 | P2.3 7.75,45.03 8.51,44.27 8.51,30.79 v8.03,30.3 v8.03,25.88 | P2.3 7.75,48.03 v4.83,50.95 | v15.8,30.3 15.9,30.3 18.67,27.53 22.8,27.53 J5.6
  Bottom 0.203: U2.27 10.19,22.75 10.19,23.44 8.03,25.6 v8.03,25.88 | v8.03,30.3 v15.8,30.3 | C28.2 R37.1 4.52,51.26 v4.83,50.95
IO38/BLK  (via drill 0.3)
  Top 0.203: v23.39,49.17 23.39,40.28 17.91,34.8 v17.91,29.92
  Bottom 0.203: U2.43 17.47,17.09 18.62,18.24 18.62,27.05 17.91,27.76 v17.91,29.92 | R41.2 22.33,50 22.33,49.48 22.63,49.17 v23.39,49.17
IO39/DB0  (via drill 0.3)
  Top 0.203: P2.7 9.75,22.61 v15.27,17.09
  Bottom 0.203: U2.44 15.84,17.09 v15.27,17.09
IO40/DB1  (via drill 0.3)
  Top 0.203: P2.8 10.25,45.17 10.16,45.09 10.16,22.99 16.76,16.38 v17.17,16.38
  Bottom 0.203: U2.45 16.11,16.26 17.04,16.26 v17.17,16.38
IO41/DB2  (via drill 0.3)
  Top 0.203: P2.9 10.75,44.99 10.57,44.81 10.57,23.22 16.82,16.97 17.55,16.97 18.19,16.33 v18.19,15.67
  Bottom 0.203: U2.47 15.79,15.44 17.96,15.44 v18.19,15.67
IO42/DB3  (via drill 0.3)
  Top 0.203: P2.10 11.25,44.85 10.97,44.58 10.97,23.39 16.94,17.42 17.8,17.42 18.8,16.43 v18.8,15.19
  Bottom 0.203: U2.48 15.63,15.04 18.64,15.04 v18.8,15.19
IO45/DB4  (via drill 0.3)
  Top 0.203: v17.65,13.69 18.24,13.69 19.33,14.78 19.33,16.64 18.09,17.88 17.04,17.88 11.38,23.55 11.38,44.35 11.75,44.72 P2.11 11.75,47.34 v11.91,47.5
  Bottom 0.203: U2.51 14.15,14.81 15.14,13.82 17.53,13.82 v17.65,13.69 | R28.2 11.89,47.47 v11.91,47.5
IO46/DB5  (via drill 0.3)
  Top 0.203: P2.12 12.25,44.58 11.79,44.12 11.79,23.77 17.22,18.34 18.39,18.34 19.79,16.94 19.79,14.58 18.26,13.06 v17.93,13.06
  Bottom 0.203: U2.52 14.99,13.41 16.92,13.41 17.27,13.06 v17.93,13.06
IO47/DB6  (via drill 0.3)
  Top 0.203: P2.13 12.75,44.5 12.19,43.94 12.19,24.03 16.05,20.17 v16.23,20.17
  Bottom 0.203: U2.37 15.53,20.17 v16.23,20.17
IO48/DB7  (via drill 0.3)
  Top 0.203: P2.14 13.25,44.37 12.6,43.71 12.6,24.23 15.88,20.95 v16.15,20.95
  Bottom 0.203: U2.36 15.75,20.95 v16.15,20.95
LEDA  (via drill 0.3)
  Top 0.203: P2.15 P2.16 13.99,45.74 13.99,45.54
  Top 0.406: v13.99,46.97 13.99,45.54
  Bottom 0.406: v13.99,46.97 C30.2 12.98,49.31 C31.2 R38.1
N$2
  Bottom 0.61: IC2.5 9.05,37.38 R1.1
N$3
  Bottom 0.406: Q6.1 19.16,52.69 C32.1 R19.1
N$6  (via drill 0.3)
  Top 0.203: USB.A5 14.25,54.81 v14.58,54.48
  Bottom 0.203: v14.58,54.48 14.58,53.73 R14.1
N$7
  Bottom 0.203: R16.2
  Bottom 0.406: PWR.C R16.2
N$8  (via drill 0.3)
  Top 0.203: P2.19 15.75,46.96 v15.6,47.12
  Bottom 0.203: v15.6,47.12 15.84,47.36 R10.1 16.02,47.9 R9.2
N$10
  Bottom 0.406: R38.2 R20.1 15.2,51.02 15.8,51.61 Q6.3
N$14  (via drill 0.3)
  Top 0.203: USB.B5 11.25,54.61 v11.43,54.43
  Bottom 0.203: R3.1 10.63,53.63 v11.43,54.43
N$15
  Bottom 0.406: R19.2 20.46,54.69 Q7.3 23.18,55.05 R11.2
N$19
  Bottom 0.203: Q7.1 23.76,51.76 R17.2 23.18,51.18 R41.1
N$25
  Bottom 0.406: CHG.- 6.2,38.9 R15.1
N$26
  Bottom 0.406: IC2.1 8.57,39.5 R15.2
N$30  (1 unrouted)
  Bottom 0.203: C12.2 11.52,9 11.53,9.02 | 11.53,9.02 11.58,9.07 | 11.58,9.3 11.58,9.02 11.51,8.94 11.51,8.51 11.53,8.48 11.53,9.02 | 11.58,9.47 L4.1 | 11.58,5.23 ANT1.FEED
  Bottom 0.762: 11.58,9.47 11.58,9.3 11.58,9.07 11.58,7.46 11.58,5.23
N$31
  Bottom 0.762: L4.2 11.58,11.47 C13.2 11.61,11.62 11.61,12.9
  pour Bottom: 11.33,12.24 11.33,13.13 11.76,13.56 11.89,13.44 11.89,12.24 11.86,12.22 11.33,12.22
N$32
  Bottom 0.203: U2.35 17.09,22.86 R29.2
N$33  (2 unrouted)
  Bottom 0.203: U2.3 | U2.3 U2.2 | 11.4,13.79 8.91,11.3 8.91,11.84 11.07,13.99 11.07,13.64 9.07,11.63
  Bottom 0.406: C19.2 9.32,12.01 11.23,13.92
  Bottom 0.61: C19.2 8.8,10.78 L1.2
N$34
  Bottom 0.61: C14.2 L2.1
N$35
  Bottom 0.203: U2.34 16,22.34 R30.2
N$37
  Bottom 0.203: U2.54 15.04,12.24 R26.2
N$38
  Bottom 0.203: U2.33 15.11,22.01 15.11,23.89 R31.2
N$40
  Bottom 0.203: U2.31 13.87,21.9 R32.2
N$41
  Bottom 0.203: U2.30 13.46,22.06 13.46,23.09 12.78,23.77 R33.2
N$63
  Bottom 0.203: U2.49 15.47,14.63 18.53,14.63 R27.2
N$65
  Bottom 0.203: U2.53 14.84,13.01 16.54,13.01 17.03,12.51 C9.2 17.87,11.48 X1.3
N$66
  Bottom 0.406: R26.1 C4.1 15.84,9.21 X1.1
N$76
  Bottom 0.61: U5.4 20.51,29.69 C11.2
SPICLK
  Bottom 0.203: U3.6 14.35,26.24 14.94,25.65 R31.1
SPICS0  (via drill 0.3)
  Top 0.203: v13.16,34.11 13.16,24.43 v14.53,23.06
  Bottom 0.203: U2.32 14.53,22 v14.53,23.06 | U3.1 11.81,34.34 12.04,34.11 v13.16,34.11
SPID
  Bottom 0.203: U3.5 15.62,27 17.09,25.53 R29.1
SPIHD
  Bottom 0.203: U3.7 13.08,25.83 12.78,25.53 R33.1
SPIQ  (via drill 0.3)
  Top 0.203: v15.77,25.68 13.97,27.48 13.97,33.17 v14.66,33.86
  Bottom 0.203: U3.2 13.08,34.95 14.17,33.86 v14.66,33.86 | R30.1 15.77,25.18 v15.77,25.68
SPIWP  (via drill 0.3)
  Top 0.203: v13.74,25.76 13.56,25.93 13.56,33.76 v14.33,34.52
  Bottom 0.203: U3.3 14.35,34.54 v14.33,34.52 | R32.1 13.87,25.63 v13.74,25.76
U0RXD
  Bottom 0.203: U2.50 15.32,14.22 18.03,14.22 18.47,13.79 18.47,12.65 19.63,11.48 RX.T
  Bottom 0.406: J5.9 22.68,16.8 22.68,12.19 21.97,11.48 RX.T
U0TXD  (via drill 0.3)
  Top 0.406: v20.17,12.39 23.65,15.88 J5.10
  Bottom 0.406: R27.1 19.21,13.06 20.17,13.06 | 20.17,13.06 TX.T | v20.17,12.39 20.17,12.42 | 20.17,12.65 20.17,13.06 | 19.79,13.03 20.17,12.65 | 20.17,12.65 20.17,12.42 | 20.17,12.42 20.62,12.88 21.13,12.88
USB_D+  (via drill 0.3)
  Top 0.203: USB.B6 12.25,54.81 12.34,54.71 | 12.34,54.71 12.7,54.71 | 12.7,54.71 13.18,54.71 | 13.18,54.71 13.23,54.76 13.26,54.79 USB.A6 | v12.68,54.59 12.68,54.69 12.7,54.71 | 12.34,54.71 12.6,54.46 12.93,54.46 13.18,54.71 | 13.18,54.71 13.06,54.59 12.62,54.59
  Bottom 0.203: R21.2 v12.68,54.59
USB_D-  (via drill 0.3)
  Top 0.203: USB.A7 12.75,56.46 12.85,56.57 13.61,56.57 13.75,56.43 USB.B7 v13.75,54.41 v13.74,54.41
  Bottom 0.203: R2.2 13.72,54.38 v13.74,54.41
VBAT  (via drill 0.3)  (1 unrouted)
  Top 0.61: v15.8,32.23 15.8,37.95 v15.39,38.35
  Bottom 0.203: Q3.3
  Bottom 0.61: IC2.3 11.11,40.95 | 11.11,40.95 R12.2 | C33.2 11.84,40.87 | 11.84,40.87 11.19,40.87 11.11,40.95 | Q3.3 v15.38,38.35 v15.39,38.35 | J6.4 4.67,34.34 8.13,34.34 10.24,32.23 v15.8,32.23 | 11.2,41.55 11.2,41.5 11.84,40.87 | 11.84,40.87 11.12,40.16 | 13.77,40.92 14.68,40.01 15.52,40.84 15.9,40.84
  Bottom 0.813: J4.1 24.01,43.88 J4.4 21.01,40.87 C8.2 14.48,40.87 | 14.48,40.87 C33.2 | Q3.3 14.67,40.67 14.48,40.87
VDD_SPI  (1 unrouted)
  Bottom 0.203: U2.29 12.73,22.6 11.58,23.75 11.58,24.3 C35.2 11.6,25.58 | 11.6,25.58 11.6,27.36 U3.8 | C37.2 11.49,25.68 11.6,25.58 | 12.85,22.02 12.98,22.15 12.98,22.84 11.99,23.82 11.99,28.17 11.61,28.17 11.61,24.33 11.79,24.16 11.79,23.77 12.8,22.76 12.8,21.97 12.68,21.84 12.68,22.68 12.42,22.94
VSYS
  Bottom 0.61: Q3.2 17.84,37.4 D3.- | D3.- 19.18,36.06 C42.2 | U5.1 18.94,34.06 | 18.94,34.06 18.94,36.3 D3.- | U5.3 20.84,33.77 20.55,34.06 19.71,34.06 | 19.43,34.06 18.94,34.06 | 19.3,35.36 19.3,34.47 19.71,34.06 | 19.71,34.06 19.43,34.06 | 19.43,34.06 18.95,33.58

### Text on the board
tPlace: MaTouch 1.9" TFT | Breakout v1.1 | www.makerfabs.com
bPlace: - | + | 5V | 3V3 | G | G | G | G | VBAT | NC | 13 | 16 | 12 | 21 | 11 | 17 | 10 | 18 | 3 | R | 2 | T | 1 | G | 3V3 | G | makerfabs.com